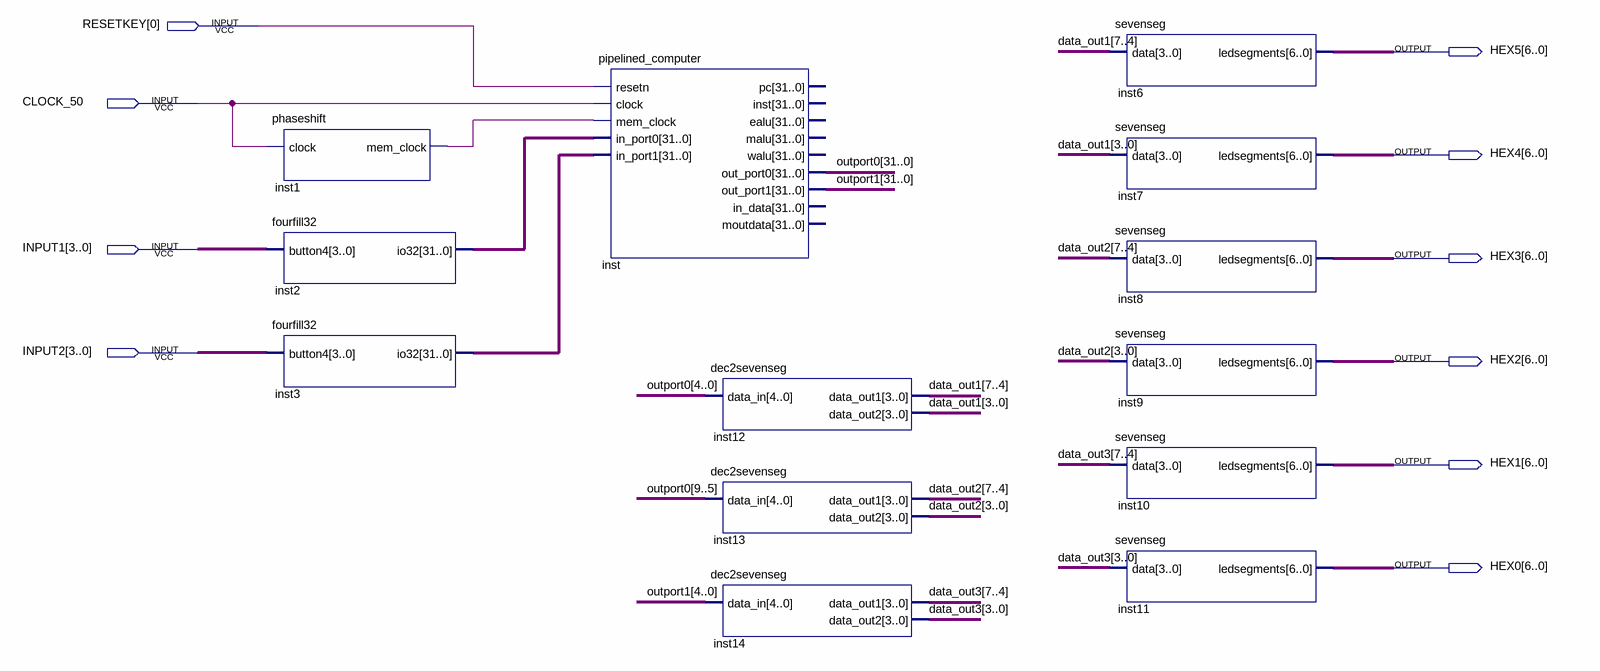
[diagram p0: schematic sheet]
// Quartus schematic pipeline_computer.bdf as structural Verilog: 13 symbols, 10 pins
module pipeline_computer (
  input  [0:0] RESETKEY,
  input  CLOCK_50,
  input  [3:0] INPUT1,
  input  [3:0] INPUT2,
  output [6:0] HEX5,
  output [6:0] HEX4,
  output [6:0] HEX3,
  output [6:0] HEX2,
  output [6:0] HEX1,
  output [6:0] HEX0
);

  wire inst1_mem_clock;
  wire [7:0] data_out1, data_out2, data_out3;
  wire [31:0] inst2_io32, inst3_io32, outport0, outport1;

  phaseshift inst1 (.clock(CLOCK_50), .mem_clock(inst1_mem_clock));
  fourfill32 inst2 (.button4(INPUT1), .io32(inst2_io32));
  fourfill32 inst3 (.button4(INPUT2), .io32(inst3_io32));
  pipelined_computer inst (
    .resetn(RESETKEY[0]), .clock(CLOCK_50), .mem_clock(inst1_mem_clock), .in_port0(inst2_io32),
    .in_port1(inst3_io32), .out_port0(outport0), .out_port1(outport1));  // open: pc, inst, ealu, malu, walu, in_data, moutdata
  dec2sevenseg inst12 (.data_in(outport0[4:0]), .data_out1(data_out1[7:4]), .data_out2(data_out1[3:0]));
  dec2sevenseg inst13 (.data_in(outport0[9:5]), .data_out1(data_out2[7:4]), .data_out2(data_out2[3:0]));
  dec2sevenseg inst14 (.data_in(outport1[4:0]), .data_out1(data_out3[7:4]), .data_out2(data_out3[3:0]));
  sevenseg inst6 (.data(data_out1[7:4]), .ledsegments(HEX5));
  sevenseg inst7 (.data(data_out1[3:0]), .ledsegments(HEX4));
  sevenseg inst8 (.data(data_out2[7:4]), .ledsegments(HEX3));
  sevenseg inst9 (.data(data_out2[3:0]), .ledsegments(HEX2));
  sevenseg inst10 (.data(data_out3[7:4]), .ledsegments(HEX1));
  sevenseg inst11 (.data(data_out3[3:0]), .ledsegments(HEX0));
endmodule
